# Altium schematic sheet main.SchDoc
size A4; SheetNumber: 1; SheetTotal: 6
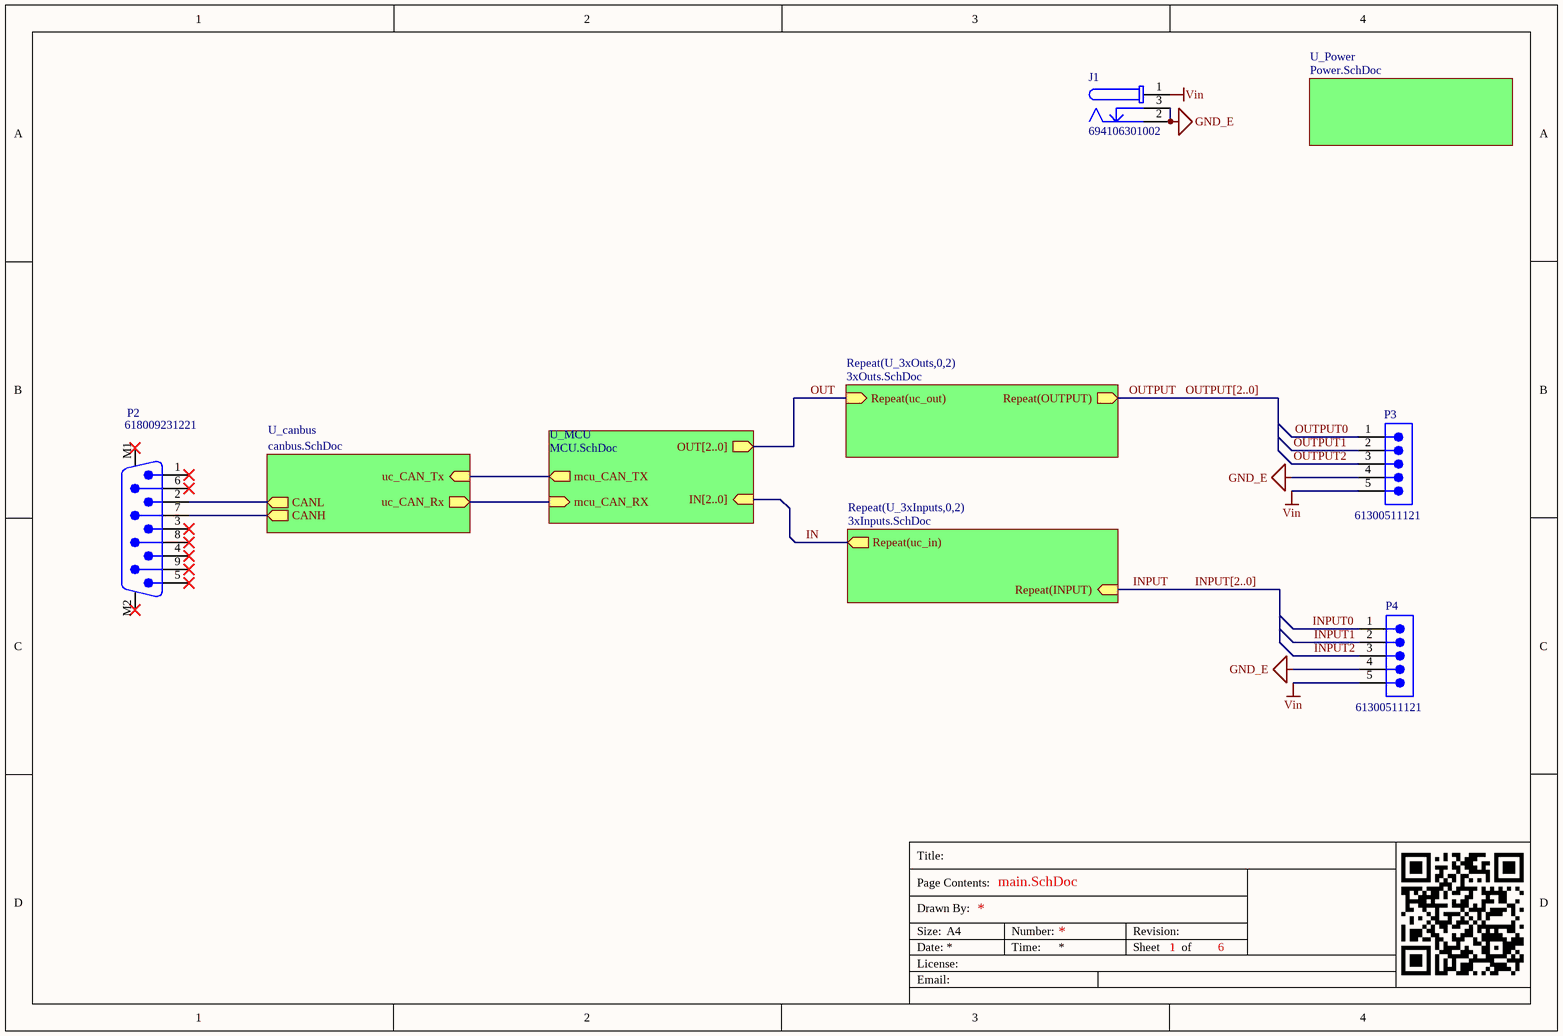
[diagram p0: main.SchDoc]

## Parts
J1  694106301002  [694106301002]
P2  618009231221  [618009231221]
P3  61300511121  [61300511121]
P4  61300511121  [61300511121]

## Sub-sheets
Repeat(U_3xInputs,0,2) = 3xInputs.SchDoc: Repeat(uc_in) (out), Repeat(INPUT) (in)
Repeat(U_3xOuts,0,2) = 3xOuts.SchDoc: Repeat(OUTPUT) (out), Repeat(uc_out) (in)
U_canbus = canbus.SchDoc: uc_CAN_Tx (in), uc_CAN_Rx (out), CANH (out), CANL (out)
U_MCU = MCU.SchDoc: mcu_CAN_TX (out), mcu_CAN_RX (in), OUT[2..0] (out), IN[2..0] (in)
U_Power = Power.SchDoc: no entries

## Nets
GND_E: J1.2 J1.3 P3.4 P4.4
Vin: J1.1 P3.5 P4.5
IN: sheet Repeat(U_3xInputs,0,2)/Repeat(uc_in)
INPUT: sheet Repeat(U_3xInputs,0,2)/Repeat(INPUT)
INPUT0: P4.1
INPUT1: P4.2
INPUT2: P4.3
OUT: sheet Repeat(U_3xOuts,0,2)/Repeat(uc_out)
OUTPUT: sheet Repeat(U_3xOuts,0,2)/Repeat(OUTPUT)
OUTPUT0: P3.1
OUTPUT1: P3.2
OUTPUT2: P3.3
NetP2_2: P2.2 ; sheet U_canbus/CANL
NetP2_7: P2.7 ; sheet U_canbus/CANH
(unnamed): sheet U_MCU/mcu_CAN_TX, sheet U_canbus/uc_CAN_Tx
(unnamed): sheet U_MCU/mcu_CAN_RX, sheet U_canbus/uc_CAN_Rx

Not connected (* = marked no-connect by the designer): P2 1* 3* 4* 5* 6* 8* 9* M1* M2*

## Buses and harness runs
bus INPUT[2..0]
bus OUTPUT[2..0]

## Notes on the sheet
- Title:
- Drawn By:
- Page Contents:
- Size:
- Date:
- License:
- Email:
- A4
- Number:
- Time:
- Revision:
- Sheet
- of

## Library data of the parts
J1 = CMP-1502-00188-2: NexarPartId: 52676100; Voltage Rating (DC): 20V; Gender: Male; Voltage Rating: 24V; Connector Type: Power; Insulation Resistance: 100MΩ; Current Rating: 5A; Shielding: Unshielded; Number of Contacts: 3; Color: Black; Housing Material: Polyamide; Contact Gender: Female; REACH SVHC: Unknown; Termination: Through Hole; Height: 11mm; RoHS: Compliant; Mount: Through Hole; Flammability Rating: UL94 V-0; Packaging: Bulk; Min Operating Temperature: -40°C; Contact Plating: Tin; Max Operating Temperature: 85°C; Operating Supply Voltage: 24V; Contact Material: Gold, Tin
P2 = CMP-1502-00284-2: NexarPartId: 22865742; Pitch: 2.77mm; Number of Contacts: 9; Operating Supply Voltage: 125V; Insulation Resistance: 5GΩ; Gender: Male; Contact Resistance: 30mΩ; Current Rating: 3A; Mount: Through Hole; Housing Material: Steel; Contact Plating: Gold; Width: 12.5mm; Insulation Material: PBT; RoHS: Compliant; Depth: 18.5mm; Contact Material: Gold; Max Operating Temperature: 105°C; Min Operating Temperature: -55°C; Termination: SMD/SMT; Height: 12.7mm; Voltage Rating: 125V; Length: 30.8mm; Orientation: Right Angle; Number of Rows: 2; Number of Pins: 9; REACH SVHC: Unknown
P3 P4 = CMP-1502-01068-3: NexarPartId: 32855526; Connector Type: Male Pin; Gender: Male; Contact Resistance: 20mΩ; Pitch: 2.54mm; Operating Supply Voltage: 250V; Current Rating: 3A; Number of Contacts: 5; Lead Free: Lead Free; Color: Black; Packaging: Bulk; Lead Pitch: 2.54mm; Contact Material: Copper; Min Operating Temperature: -40°C; Contact Mating Length: 5.9944mm; Voltage Rating: 250V; Number of Pins: 5; Number of Positions: 5; Height: 8.89mm; Orientation: Vertical; REACH SVHC: Unknown; RoHS: Compliant; Contact Plating: Gold; Max Operating Temperature: 105°C; Mount: Through Hole; Number of Rows: 1; Termination: Solder